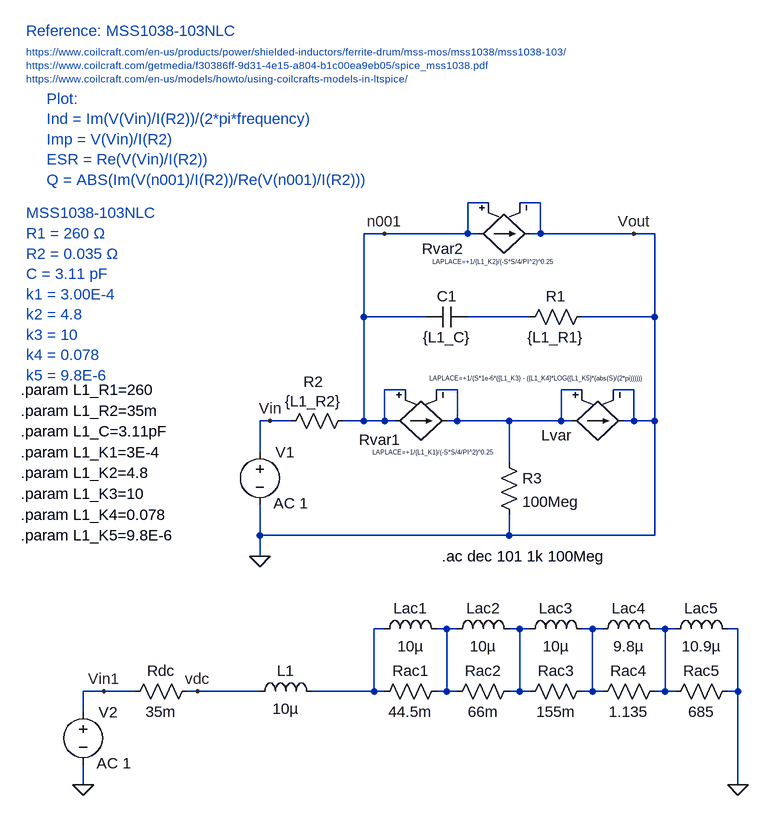
[diagram p0: schematic 03-MSS1038-103_non-linear_model.asc]
03-MSS1038-103_non-linear_model.asc, the LTspice schematic file:
Version 4
SHEET 1 1668 1520
WIRE 320 48 288 48
WIRE 400 48 368 48
WIRE 160 96 128 96
WIRE 288 96 288 48
WIRE 288 96 160 96
WIRE 304 96 288 96
WIRE 400 96 400 48
WIRE 400 96 384 96
WIRE 544 96 400 96
WIRE 576 96 544 96
WIRE 128 224 128 96
WIRE 224 224 128 224
WIRE 384 224 288 224
WIRE 576 224 576 96
WIRE 576 224 464 224
WIRE 192 336 160 336
WIRE 272 336 240 336
WIRE 464 336 432 336
WIRE 544 336 512 336
WIRE -16 384 -32 384
WIRE 16 384 -16 384
WIRE 128 384 128 224
WIRE 128 384 96 384
WIRE 160 384 160 336
WIRE 160 384 128 384
WIRE 176 384 160 384
WIRE 272 384 272 336
WIRE 272 384 256 384
WIRE 352 384 272 384
WIRE 432 384 432 336
WIRE 432 384 352 384
WIRE 448 384 432 384
WIRE 544 384 544 336
WIRE 544 384 528 384
WIRE 576 384 576 224
WIRE 576 384 544 384
WIRE -32 432 -32 384
WIRE 352 448 352 384
WIRE -32 560 -32 512
WIRE 352 560 352 528
WIRE 352 560 -32 560
WIRE 576 560 576 384
WIRE 576 560 352 560
WIRE -32 592 -32 560
WIRE 160 704 144 704
WIRE 256 704 240 704
WIRE 272 704 256 704
WIRE 368 704 352 704
WIRE 384 704 368 704
WIRE 480 704 464 704
WIRE 496 704 480 704
WIRE 592 704 576 704
WIRE 608 704 592 704
WIRE 704 704 688 704
WIRE -272 800 -304 800
WIRE -224 800 -272 800
WIRE -128 800 -144 800
WIRE -32 800 -128 800
WIRE 144 800 144 704
WIRE 144 800 48 800
WIRE 160 800 144 800
WIRE 256 800 256 704
WIRE 256 800 240 800
WIRE 272 800 256 800
WIRE 368 800 368 704
WIRE 368 800 352 800
WIRE 384 800 368 800
WIRE 480 800 480 704
WIRE 480 800 464 800
WIRE 496 800 480 800
WIRE 592 800 592 704
WIRE 592 800 576 800
WIRE 608 800 592 800
WIRE 704 800 704 704
WIRE 704 800 688 800
WIRE -304 832 -304 800
WIRE -304 944 -304 912
WIRE 704 944 704 800
FLAG -32 592 0
FLAG -16 384 Vin
FLAG 544 96 Vout
FLAG 160 96 n001
FLAG -304 944 0
FLAG 704 944 0
FLAG -272 800 Vin1
FLAG -128 800 vdc
SYMBOL voltage -32 416 R0
WINDOW 123 21 95 Left 2
WINDOW 39 0 0 Left 0
SYMATTR Value2 AC 1
SYMATTR InstName V1
SYMATTR Value ""
SYMBOL res 112 368 R90
WINDOW 0 -29 61 VBottom 2
WINDOW 3 -30 61 VTop 2
SYMATTR InstName R2
SYMATTR Value {L1_R2}
SYMBOL g2 400 96 R90
WINDOW 0 23 118 VRight 2
WINDOW 3 43 -20 VRight 0
SYMATTR InstName Rvar2
SYMATTR Value LAPLACE=+1/{L1_K2}/(-S*S/4/PI^2)^0.25
SYMBOL cap 288 208 R90
WINDOW 0 0 32 VBottom 2
WINDOW 3 32 32 VTop 2
SYMATTR InstName C1
SYMATTR Value {L1_C}
SYMBOL res 480 208 R90
WINDOW 0 0 56 VBottom 2
WINDOW 3 32 56 VTop 2
SYMATTR InstName R1
SYMATTR Value {L1_R1}
SYMBOL g2 272 384 R90
WINDOW 0 29 87 VRight 2
WINDOW 3 48 -56 VRight 0
SYMATTR InstName Rvar1
SYMATTR Value LAPLACE=+1/{L1_K1}/(-S*S/4/PI^2)^0.25
SYMBOL g2 544 384 R90
WINDOW 0 22 95 VRight 2
WINDOW 3 -66 -21 VRight 0
SYMATTR InstName Lvar
SYMATTR Value LAPLACE=+1/(S*1e-6*({L1_K3} - ({L1_K4}*LOG({L1_K5}*(abs(S)/(2*pi))))))
SYMBOL res 336 432 R0
SYMATTR InstName R3
SYMATTR Value 100Meg
SYMBOL voltage -304 816 R0
WINDOW 123 21 95 Left 2
WINDOW 39 0 0 Left 0
SYMATTR Value2 AC 1
SYMATTR InstName V2
SYMATTR Value ""
SYMBOL res -128 784 R90
WINDOW 0 0 56 VBottom 2
WINDOW 3 32 56 VTop 2
SYMATTR InstName Rdc
SYMATTR Value 35m
SYMBOL res 256 784 R90
WINDOW 0 0 56 VBottom 2
WINDOW 3 32 56 VTop 2
SYMATTR InstName Rac1
SYMATTR Value 44.5m
SYMBOL res 368 784 R90
WINDOW 0 0 56 VBottom 2
WINDOW 3 32 56 VTop 2
SYMATTR InstName Rac2
SYMATTR Value 66m
SYMBOL res 480 784 R90
WINDOW 0 0 56 VBottom 2
WINDOW 3 32 56 VTop 2
SYMATTR InstName Rac3
SYMATTR Value 155m
SYMBOL res 592 784 R90
WINDOW 0 0 56 VBottom 2
WINDOW 3 32 56 VTop 2
SYMATTR InstName Rac4
SYMATTR Value 1.135
SYMBOL res 704 784 R90
WINDOW 0 0 56 VBottom 2
WINDOW 3 32 56 VTop 2
SYMATTR InstName Rac5
SYMATTR Value 685
SYMBOL ind 144 720 R270
WINDOW 0 32 56 VTop 2
WINDOW 3 5 56 VBottom 2
SYMATTR InstName Lac1
SYMATTR Value 10µ
SYMBOL ind 256 720 R270
WINDOW 0 32 56 VTop 2
WINDOW 3 5 56 VBottom 2
SYMATTR InstName Lac2
SYMATTR Value 10µ
SYMBOL ind 368 720 R270
WINDOW 0 32 56 VTop 2
WINDOW 3 5 56 VBottom 2
SYMATTR InstName Lac3
SYMATTR Value 10µ
SYMBOL ind 480 720 R270
WINDOW 0 32 56 VTop 2
WINDOW 3 5 56 VBottom 2
SYMATTR InstName Lac4
SYMATTR Value 9.8µ
SYMBOL ind 592 720 R270
WINDOW 0 32 56 VTop 2
WINDOW 3 5 56 VBottom 2
SYMATTR InstName Lac5
SYMATTR Value 10.9µ
SYMBOL ind -48 816 R270
WINDOW 0 32 56 VTop 2
WINDOW 3 5 56 VBottom 2
SYMATTR InstName L1
SYMATTR Value 10µ
TEXT 248 592 Left 2 !.ac dec 101 1k 100Meg
TEXT -392 -216 Left 2 ;Reference: MSS1038-103NLC
TEXT -392 -184 Left 1 ;https://www.coilcraft.com/en-us/products/power/shielded-inductors/ferrite-drum/mss-mos/mss1038/mss1038-103/\nhttps://www.coilcraft.com/getmedia/f30386ff-9d31-4e15-a804-b1c00ea9eb05/spice_mss1038.pdf\nhttps://www.coilcraft.com/en-us/models/howto/using-coilcrafts-models-in-ltspice/
TEXT -392 64 Left 2 ;MSS1038-103NLC\nR1 = 260 Ω\nR2 = 0.035 Ω\nC = 3.11 pF\nk1 = 3.00E-4\nk2 = 4.8\nk3 = 10\nk4 = 0.078\nk5 = 9.8E-6
TEXT -400 336 Left 2 !.param L1_R1=260
TEXT -400 368 Left 2 !.param L1_R2=35m
TEXT -400 400 Left 2 !.param L1_C=3.11pF
TEXT -400 432 Left 2 !.param L1_K1=3E-4
TEXT -400 464 Left 2 !.param L1_K2=4.8
TEXT -400 496 Left 2 !.param L1_K3=10
TEXT -400 528 Left 2 !.param L1_K4=0.078
TEXT -400 560 Left 2 !.param L1_K5=9.8E-6
TEXT -360 -112 Left 2 ;Plot:\nInd = Im(V(Vin)/I(R2))/(2*pi*frequency)\nImp = V(Vin)/I(R2)\nESR = Re(V(Vin)/I(R2))\nQ = ABS(Im(V(n001)/I(R2))/Re(V(n001)/I(R2)))

The netlist it stands for:
* 03-MSS1038-103_non-linear_model.asc
V1 Vin 0 AC 1
R2 n001 Vin {L1_R2}
G§Rvar2 n001 0 n001 0 LAPLACE=+1/{L1_K2}/(-S*S/4/PI^2)^0.25
C1 N002 n001 {L1_C}
R1 0 N002 {L1_R1}
G§Rvar1 n001 N003 n001 N003 LAPLACE=+1/{L1_K1}/(-S*S/4/PI^2)^0.25
G§Lvar N003 0 N003 0 LAPLACE=+1/(S*1e-6*({L1_K3} - ({L1_K4}*LOG({L1_K5}*(abs(S)/(2*pi))))))
R3 N003 0 100Meg
V2 Vin1 0 AC 1
Rdc vdc Vin1 35m
Rac1 N005 N004 44.5m
Rac2 N006 N005 66m
Rac3 N007 N006 155m
Rac4 N008 N007 1.135
Rac5 0 N008 685
Lac1 N004 N005 10µ
Lac2 N005 N006 10µ
Lac3 N006 N007 10µ
Lac4 N007 N008 9.8µ
Lac5 N008 0 10.9µ
L1 vdc N004 10µ
.ac dec 101 1k 100Meg
* Reference: MSS1038-103NLC
* https://www.coilcraft.com/en-us/products/power/shielded-inductors/ferrite-drum/mss-mos/mss1038/mss1038-103/
* https://www.coilcraft.com/getmedia/f30386ff-9d31-4e15-a804-b1c00ea9eb05/spice_mss1038.pdf
* https://www.coilcraft.com/en-us/models/howto/using-coilcrafts-models-in-ltspice/
* MSS1038-103NLC
* R1 = 260 Ω
* R2 = 0.035 Ω
* C = 3.11 pF
* k1 = 3.00E-4
* k2 = 4.8
* k3 = 10
* k4 = 0.078
* k5 = 9.8E-6
.param L1_R1=260
.param L1_R2=35m
.param L1_C=3.11pF
.param L1_K1=3E-4
.param L1_K2=4.8
.param L1_K3=10
.param L1_K4=0.078
.param L1_K5=9.8E-6
* Plot:
* Ind = Im(V(Vin)/I(R2))/(2*pi*frequency)
* Imp = V(Vin)/I(R2)
* ESR = Re(V(Vin)/I(R2))
* Q = ABS(Im(V(n001)/I(R2))/Re(V(n001)/I(R2)))
.backanno
.end

* Results of the author's LTspice run, read from the files saved beside the schematic
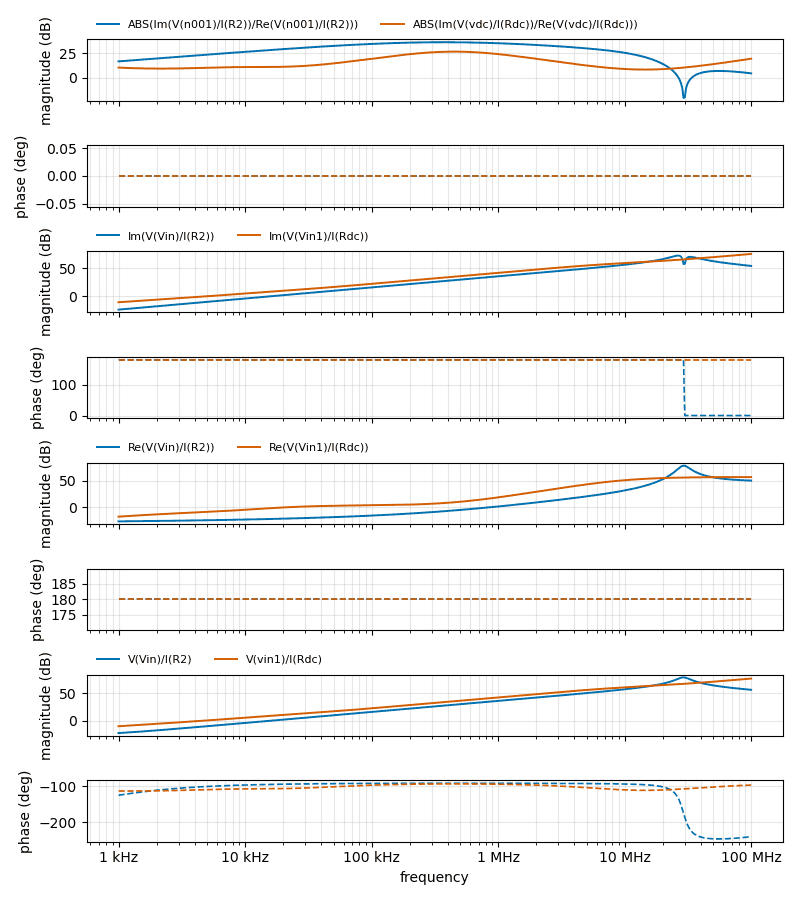
[diagram p1: AC Analysis of 03-MSS1038-103_non-linear_model.asc, plotted from the saved traces]
* AC Analysis, 1 run:
*   ABS(Im(V(n001)/I(R2))/Re(V(n001)/I(R2))): 16.70 dB at 1 kHz, 4.66 dB at 100 MHz, peak 36.02 dB at 375.2 kHz, 3 dB below the peak at 62.07 kHz and 2.179 MHz
*   ABS(Im(V(vdc)/I(Rdc))/Re(V(vdc)/I(Rdc))): 10.46 dB at 1 kHz, 19.41 dB at 100 MHz, peak 26.53 dB at 450.3 kHz, 3 dB below the peak at 184.8 kHz and 1.097 MHz
*   Im(V(Vin)/I(R2)): -23.73 dB at 1 kHz, 54.62 dB at 100 MHz, peak 73.13 dB at 26.65 MHz, 3 dB below the peak at 23.01 MHz and 28.08 MHz
*   Im(V(Vin1)/I(Rdc)): -10.48 dB at 1 kHz, 76.06 dB at 100 MHz, peak 76.06 dB at 100 MHz, 3 dB below the peak at 69.95 MHz
*   Re(V(Vin)/I(R2)): -27.03 dB at 1 kHz, 49.96 dB at 100 MHz, peak 78.20 dB at 29.2 MHz, 3 dB below the peak at 27.39 MHz and 31.55 MHz
*   Re(V(Vin1)/I(Rdc)): -18.08 dB at 1 kHz, 56.65 dB at 100 MHz, peak 56.65 dB at 100 MHz, 3 dB below the peak at 15.26 MHz
*   V(Vin)/I(R2): -22.06 dB at 1 kHz, 55.89 dB at 100 MHz, peak 78.24 dB at 29.2 MHz, 3 dB below the peak at 26.12 MHz and 32.45 MHz
*   V(vin1)/I(Rdc): -9.79 dB at 1 kHz, 76.11 dB at 100 MHz, peak 76.11 dB at 100 MHz, 3 dB below the peak at 69.54 MHz